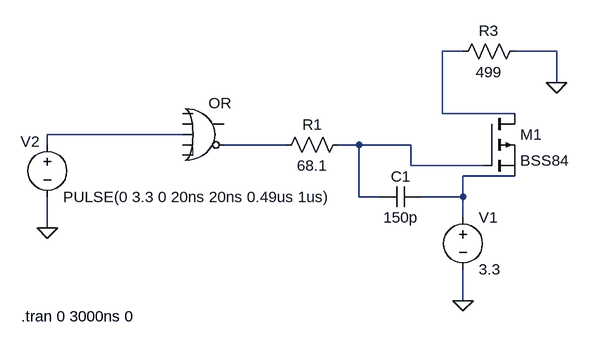
[diagram p0: schematic SP_Adapter_mosfet2.asc]
SP_Adapter_mosfet2.asc, the LTspice schematic file:
Version 4
SHEET 1 880 680
WIRE 512 48 480 48
WIRE 656 48 592 48
WIRE 656 96 656 48
WIRE 480 144 480 48
WIRE 592 144 480 144
WIRE 80 176 -128 176
WIRE -128 192 -128 176
WIRE 240 192 144 192
WIRE 352 192 320 192
WIRE 432 192 352 192
WIRE 432 224 432 192
WIRE 544 224 432 224
WIRE 592 240 512 240
WIRE 352 272 352 192
WIRE 384 272 352 272
WIRE 512 272 512 240
WIRE 512 272 448 272
WIRE 512 304 512 272
WIRE -128 320 -128 272
WIRE 512 432 512 384
FLAG 512 432 0
FLAG 656 96 0
FLAG -128 320 0
SYMBOL Digital\\or 112 112 R0
WINDOW 3 0 0 Invisible 2
SYMATTR Value Vhigh=3.3 Ref=2.1 td=10ns
SYMATTR InstName OR
SYMBOL voltage 512 288 R0
WINDOW 123 0 0 Left 2
WINDOW 39 0 0 Left 2
SYMATTR InstName V1
SYMATTR Value 3.3
SYMBOL res 336 176 R90
WINDOW 0 0 56 VBottom 2
WINDOW 3 32 56 VTop 2
SYMATTR InstName R1
SYMATTR Value 68.1
SYMATTR SpiceLine tol=1 pwr=0.1
SYMBOL res 608 32 R90
WINDOW 0 0 56 VBottom 2
WINDOW 3 32 56 VTop 2
SYMATTR InstName R3
SYMATTR Value 499
SYMATTR SpiceLine tol=1 pwr=0.1
SYMBOL voltage -128 176 R0
WINDOW 0 -41 11 Left 2
WINDOW 123 0 0 Left 2
WINDOW 39 0 0 Left 2
SYMATTR InstName V2
SYMATTR Value PULSE(0 3.3 0 20ns 20ns 0.49us 1us)
SYMBOL pmos 544 144 R0
SYMATTR InstName M1
SYMATTR Value BSS84
SYMBOL cap 448 256 R90
WINDOW 0 0 32 VBottom 2
WINDOW 3 32 32 VTop 2
SYMATTR InstName C1
SYMATTR Value 150p
SYMATTR SpiceLine V=10 Irms=0 Rser=0.13207 Lser=414.008p mfg="Würth Elektronik" pn="885012007005 WCAP-CSGP 0805" type="NP0"
TEXT -168 456 Left 2 !.tran 0 3000ns 0

The netlist it stands for:
* SP_Adapter_mosfet2.asc
A§OR 0 0 N002 0 0 N003 0 0 OR Vhigh=3.3 Ref=2.1 td=10ns
V1 N005 0 3.3
R1 N004 N003 68.1 tol=1 pwr=0.1
R3 0 N001 499 tol=1 pwr=0.1
V2 N002 0 PULSE(0 3.3 0 20ns 20ns 0.49us 1us)
M1 N001 N004 N005 N005 BSS84
C1 N005 N004 150p V=10 Irms=0 Rser=0.13207 Lser=414.008p mfg="Würth Elektronik" pn="885012007005 WCAP-CSGP 0805" type="NP0"
.model NMOS NMOS
.model PMOS PMOS
.lib standard.mos
.tran 0 3000ns 0
.backanno
.end